# EAGLE design LedMatrix (EAGLE 6.5.0)
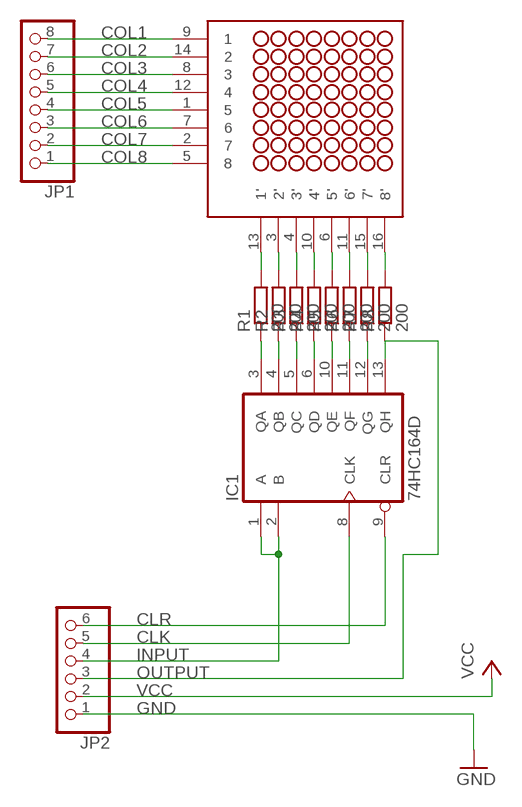
[diagram p0: schematic, sheet 1]

## Parts
IC1  74HC164D  [SO14]
JP1  PINHD-1X8  [1X08]
JP2  PINHD-1X6  [1X06]
R1  200  R-EU_R1206  [R1206]
R2  200  R-EU_R1206  [R1206]
R3  200  R-EU_R1206  [R1206]
R4  200  R-EU_R1206  [R1206]
R5  200  R-EU_R1206  [R1206]
R6  200  R-EU_R1206  [R1206]
R7  200  R-EU_R1206  [R1206]
R8  200  R-EU_R1206  [R1206]
U$1  NFM-12881BG-11  [NFM-12881BG-11]

## Nets
CLK: IC1.8(CLK) JP2.5
CLR: IC1.9(CLR) JP2.6
COL1: JP1.8 U$1.9
COL2: JP1.7 U$1.14
COL3: JP1.6 U$1.8
COL4: JP1.5 U$1.12
COL5: JP1.4 U$1.1
COL6: JP1.3 U$1.7
COL7: JP1.2 U$1.2
COL8: JP1.1 U$1.5
GND: JP2.1
INPUT: IC1.1(A) IC1.2(B) JP2.4
N$1: R1.2 U$1.13(1')
N$2: R2.2 U$1.3(2')
N$3: R3.2 U$1.4(3')
N$4: R4.2 U$1.10(4')
N$5: R5.2 U$1.6(5')
N$6: R6.2 U$1.11(6')
N$7: R7.2 U$1.15(7')
N$8: R8.2 U$1.16(8')
N$9: IC1.3(QA) R1.1
N$10: IC1.4(QB) R2.1
N$11: IC1.5(QC) R3.1
N$12: IC1.6(QD) R4.1
N$13: IC1.10(QE) R5.1
N$14: IC1.11(QF) R6.1
N$15: IC1.12(QG) R7.1
OUTPUT: IC1.13(QH) JP2.3 R8.1
VCC: JP2.2

## Power pins joined to a net without a drawn wire
GND: IC1.7(GND)
VCC: IC1.14(VCC)

## Library data of the parts
IC1 = 74xx-us:74*164: 8-bit parallel out SHIFT REGISTER
JP1 = pinhead:PINHD-1X8: PIN HEADER
JP2 = pinhead:PINHD-1X6: PIN HEADER
R1-R8 = resistor:R-EU_: RESISTOR, European symbol
U$1 = led_matrix_8x8:NFM-12881BG-11: Futurlec 8x8 LED Matrix

## Board
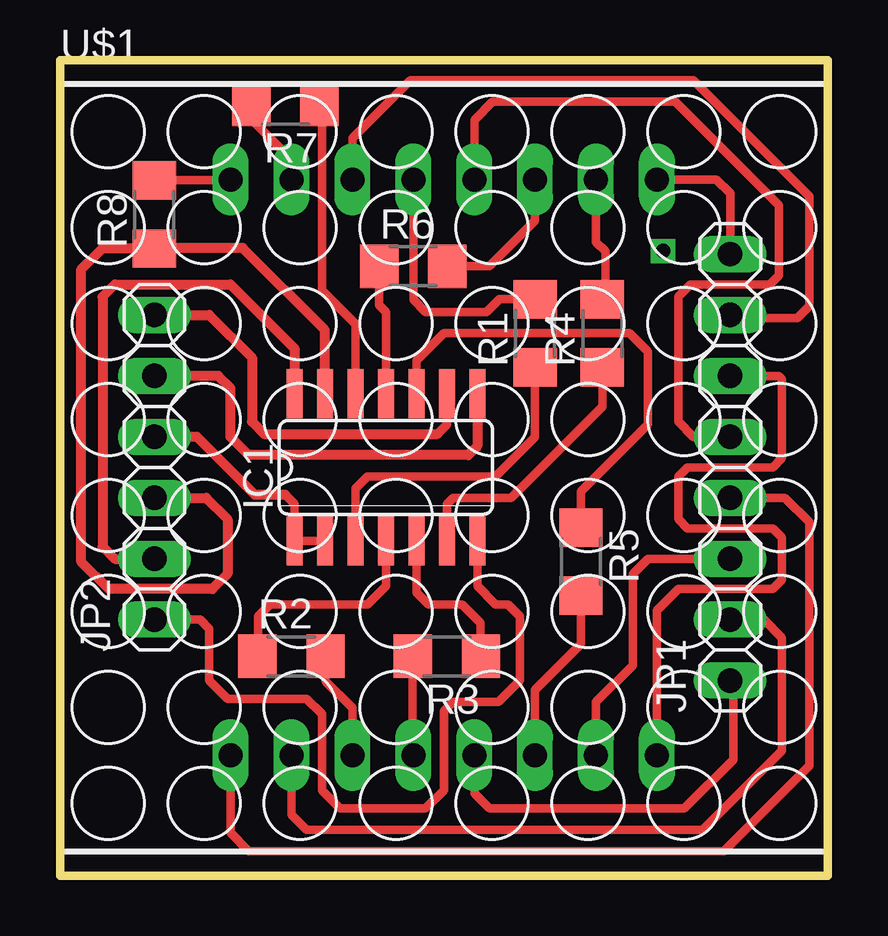
[diagram p1: board, top side]

Size 32 x 34 mm. Coordinates in mm from the lower left corner, seen from the top.
Outline: 0,0 0,34 32,34 32,0 0,0
Copper layers (1*16): Top 0.035mm / dielectric 1.5mm / Bottom 0.035mm
Design rules "default": minimum track width 10mil, minimum drill 24mil, track to track 8mil, track to pad 8mil, pad to pad 8mil, via to via 8mil, smd to smd 8mil, copper to edge 40mil, drill to drill 8mil, minimum pad ring 10mil, minimum via ring 8mil, stop-mask expansion 4mil, vias tented up to drill 0mil, thermal gap 10mil

### Footprints (pad centres in the part's own frame; a part is rotated, then mirrored left to right if it is on the bottom)
SO14 = smd 0.66 x 2.032: 1 -3.81,-3.073; 2 -2.54,-3.073; 3 -1.27,-3.073; 4 0,-3.073; 5 1.27,-3.073; 6 2.54,-3.073; 7 3.81,-3.073; 8 3.81,3.073; 9 2.54,3.073; 10 1.27,3.073; 11 0,3.073; 12 -1.27,3.073; 13 -2.54,3.073; 14 -3.81,3.073
1X08 = drill 1.016 long: 1 -8.89,0; 2 -6.35,0; 3 -3.81,0; 4 -1.27,0; 5 1.27,0; 6 3.81,0; 7 6.35,0; 8 8.89,0
1X06 = drill 1.016 long: 1 -6.35,0; 2 -3.81,0; 3 -1.27,0; 4 1.27,0; 5 3.81,0; 6 6.35,0
R1206 = smd 1.6 x 1.803: 1 -1.422,0; 2 1.422,0
NFM-12881BG-11 = drill 1 long: 1 -8.89,-12; 2 -6.35,-12; 3 -3.81,-12; 4 -1.27,-12; 5 1.27,-12; 6 3.81,-12; 7 6.35,-12; 8 8.89,-12; 9 8.89,12; 10 6.35,12; 11 3.81,12; 12 1.27,12; 13 -1.27,12; 14 -3.81,12; 15 -6.35,12; 16 -8.89,12

### Placement (x,y rotation side)
IC1  13.59,17.02 0 top
JP1  27.94,17.02 90 top
JP2  3.94,17.02 90 top
R1  19.81,22.61 90 top
R2  9.65,9.14 0 top
R3  16.13,9.14 180 top
R4  22.61,22.61 90 top
R5  21.72,13.08 270 top
R6  14.73,25.4 0 top
R7  9.4,32.13 180 top
R8  3.94,27.56 90 top
U$1  16,17.02 0 top

### Tracks (layer width: path | path; a pad name or v marks a point on that pad's centre or on a via)
CLK
  Top 0.406: IC1.8 17.4,17.91 17.02,17.53 7.87,17.53 7.11,18.29 7.11,20.32 6.6,20.83 JP2.5
CLR
  Top 0.356: IC1.9 16.13,18.8 15.75,18.41
  Top 0.406: JP2.6 6.22,23.37 8,21.59 8,18.92 8.51,18.41 15.75,18.41
COL1
  Top 0.356: U$1.9 27.37,29.02 27.94,28.45 JP1.8
COL2
  Top 0.356: U$1.14 12.19,30.73 14.61,33.15 26.42,33.15 31.24,28.32 31.24,23.75 30.73,23.24 28.07,23.24 JP1.7
COL3
  Top 0.356: U$1.8 24.89,11.05 25.78,11.94 29.72,11.94 30.1,12.32 30.1,14.1 29.72,14.48 26.16,14.48 25.78,14.86 25.78,16.64 26.16,17.02 29.72,17.02 30.1,17.4 30.1,20.7 29.97,20.83 JP1.6
COL4
  Top 0.356: JP1.5 26.42,18.29 25.78,18.92 25.78,24.13 26.29,24.64 29.59,24.64 29.97,25.02 29.97,27.94 25.65,32.26 18.03,32.26 17.27,31.5 U$1.12
COL5
  Top 0.356: U$1.1 7.11,1.78 7.87,1.02 27.69,1.02 31.24,4.57 31.24,14.73 30.23,15.75 JP1.4
COL6
  Top 0.356: U$1.7 22.35,7.24 23.88,8.76 23.88,12.57 24.51,13.21 JP1.3
COL7
  Top 0.356: U$1.2 9.65,2.54 10.29,1.91 26.8,1.91 30.1,5.21 30.1,9.91 29.34,10.67 JP1.2
COL8
  Top 0.356: U$1.5 17.27,3.43 17.91,2.79 26.04,2.79 28.07,4.83 28.07,8 JP1.1
GND
  Top 0.356: IC1.7 17.4,12.06 18.16,11.3 18.67,11.3 19.18,10.79 19.18,8.13 18.29,7.24 16.38,7.24 16,6.86 16,3.56 15.24,2.79 11.68,2.79 10.92,3.56 10.92,6.73 10.29,7.37 6.99,7.37 6.22,8.13 6.22,10.29 5.84,10.67 JP2.1
INPUT
  Top 0.356: IC1.2 IC1.1 9.78,15.49 9.4,15.88
  Top 0.406: 9.4,15.88 8.13,15.88 5.71,18.29 JP2.4
N$1
  Top 0.356: R1.2 18.31,24.03 17.78,23.5 15.24,23.5 14.73,24 U$1.13
N$2
  Top 0.356: R2.2 11.07,8.1 12.19,6.99 U$1.3
N$3
  Top 0.356: R3.2 14.71,5.04 U$1.4
N$4
  Top 0.356: U$1.10 22.35,26.42 22.73,26.04 22.73,24.16 R4.2
N$5
  Top 0.356: R5.2 21.72,9.65 19.81,7.75 U$1.6
N$6
  Top 0.356: U$1.11 19.81,27.3 17.91,25.4 R6.2
N$7
  Top 0.356: U$1.15 9.53,29.14 9.53,29.97 7.98,31.52 R7.2
N$8
  Top 0.356: R8.2 7.08,28.98 U$1.16
N$9
  Top 0.356: IC1.3 12.32,16.13 12.83,16.64 18.16,16.64 19.81,18.29 R1.1
N$10
  Top 0.356: IC1.4 13.59,12.06 12.83,11.3 8.76,11.3 8.26,10.79 8.26,9.17 R2.1
N$11
  Top 0.356: IC1.5 14.86,11.81 15.37,11.3 16.76,11.3 17.53,10.54 17.53,9.17 R3.1
N$12
  Top 0.356: IC1.6 16.13,15.49 16.38,15.75 18.8,15.75 22.61,19.56 R4.1
N$13
  Top 0.356: IC1.10 14.86,21.46 16,22.61 23.75,22.61 24.51,21.84 24.51,18.8 21.72,16 R5.1
N$14
  Top 0.356: R6.1 13.31,23.77 13.59,23.5 IC1.11
N$15
  Top 0.356: R7.1 10.92,32.03 10.92,24.38 12.32,22.99 IC1.12
N$25  (via drill 0.6)
  other vias: 25.15,26.04
OUTPUT
  Top 0.406: IC1.13 11.05,22.73 7.62,26.16 3.96,26.16 R8.1 3.91,26.16 1.78,26.16 0.89,25.27 0.89,13.08 2.03,11.94 6.35,11.94 6.99,12.57 6.99,14.86 6.1,15.75 JP2.3
VCC
  Top 0.406: JP2.2 2.29,13.21 1.78,13.72 1.78,24.13 2.29,24.64 7.11,24.64 9.78,21.97 IC1.14